# EAGLE design RES8 (EAGLE 5.11)
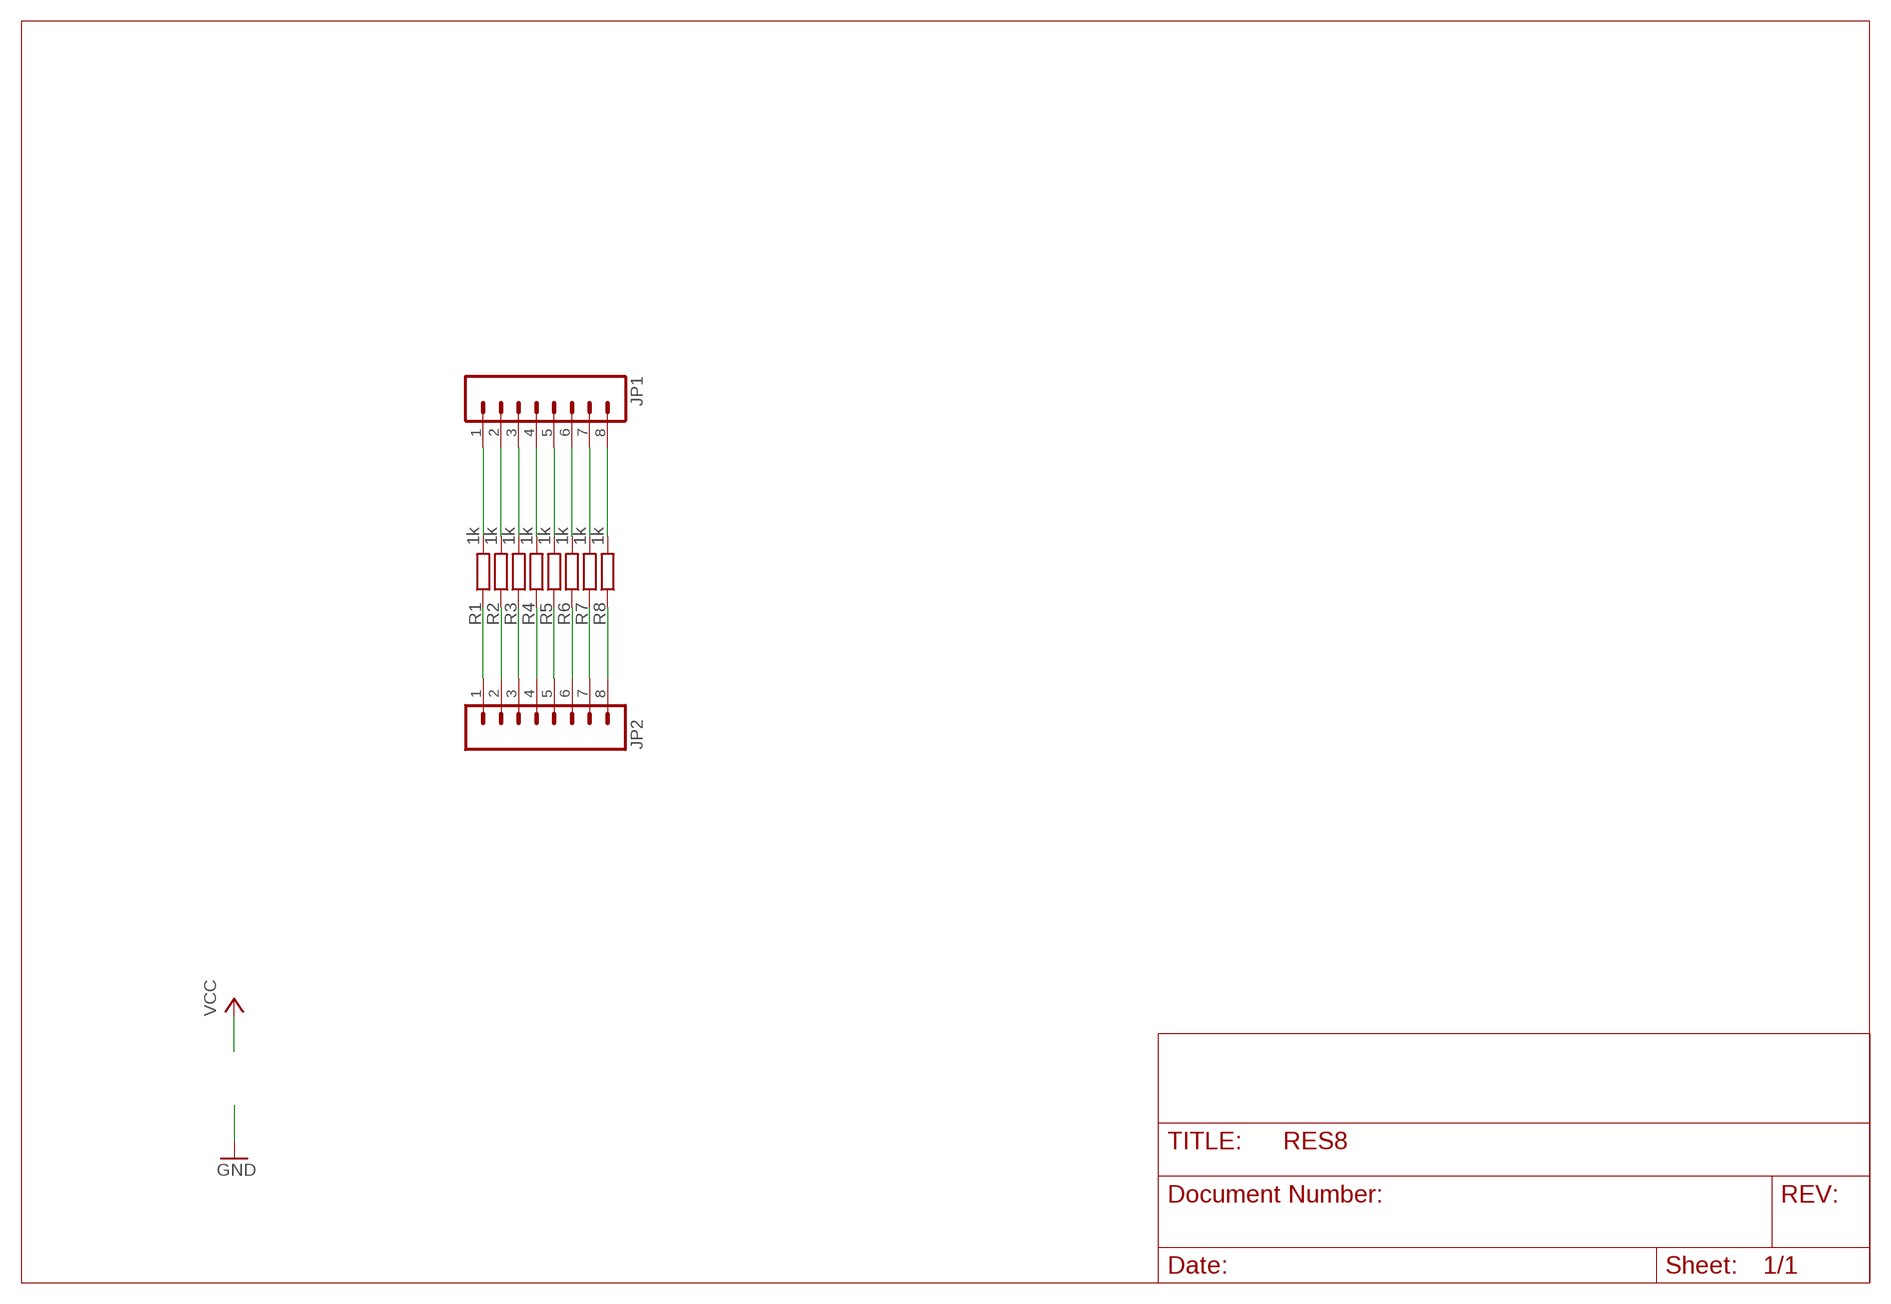
[diagram p0: schematic, sheet 1]

## Parts
JP1  HEADER_1X08PTH  [1X08]
JP2  HEADER_1X08PTH  [1X08]
R1  1k  R-EU_0207/7  [0207/7]
R2  1k  R-EU_0207/7  [0207/7]
R3  1k  R-EU_0207/7  [0207/7]
R4  1k  R-EU_0207/7  [0207/7]
R5  1k  R-EU_0207/7  [0207/7]
R6  1k  R-EU_0207/7  [0207/7]
R7  1k  R-EU_0207/7  [0207/7]
R8  1k  R-EU_0207/7  [0207/7]

## Nets
N$1: JP2.1 R1.1
N$2: JP2.2 R2.1
N$3: JP2.3 R3.1
N$4: JP2.4 R4.1
N$5: JP2.5 R5.1
N$7: JP2.6 R6.1
N$8: JP2.7 R7.1
N$9: JP2.8 R8.1
N$10: JP1.8 R8.2
N$11: JP1.7 R7.2
N$12: JP1.6 R6.2
N$13: JP1.5 R5.2
N$14: JP1.4 R4.2
N$15: JP1.3 R3.2
N$16: JP1.2 R2.2
N$17: JP1.1 R1.2

## Library data of the parts
JP1 JP2 = MyLibrary:HEADER_1X08: Header 8 Standard 8-pin 0.1" header. Use with straight break away headers (SKU : PRT-00116), right angle break away headers (PRT-00553), swiss pins (PRT-00743), machine pins (PRT-00117), and female headers (PRT-00115).
R1-R8 = MyLibrary:R-EU_: RESISTOR, European symbol

## Net classes
0 default: width 0.381 mm, drill 0.9 mm, clearance 0.254 mm
1 GND: width 0.254 mm, drill 0.9 mm, clearance 0.254 mm to class 0, clearance 0.254 mm
2 Border: width 0.254 mm, drill 0.9 mm, clearance 0.254 mm to class 0, clearance 0.254 mm to class 1, clearance 0.254 mm
3 VCC: width 0.635 mm, drill 0.9 mm, clearance 0.254 mm to class 0, clearance 0.254 mm to class 1, clearance 0.254 mm to class 2, clearance 0.254 mm

## Board
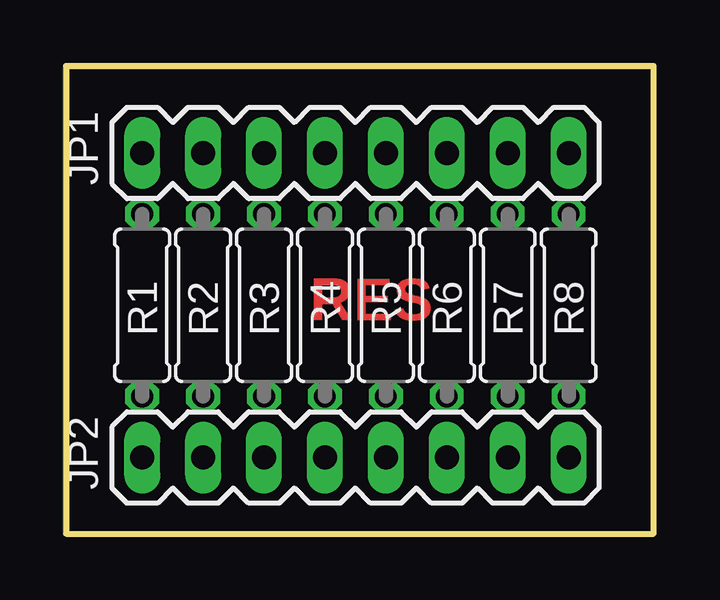
[diagram p1: board, top side]
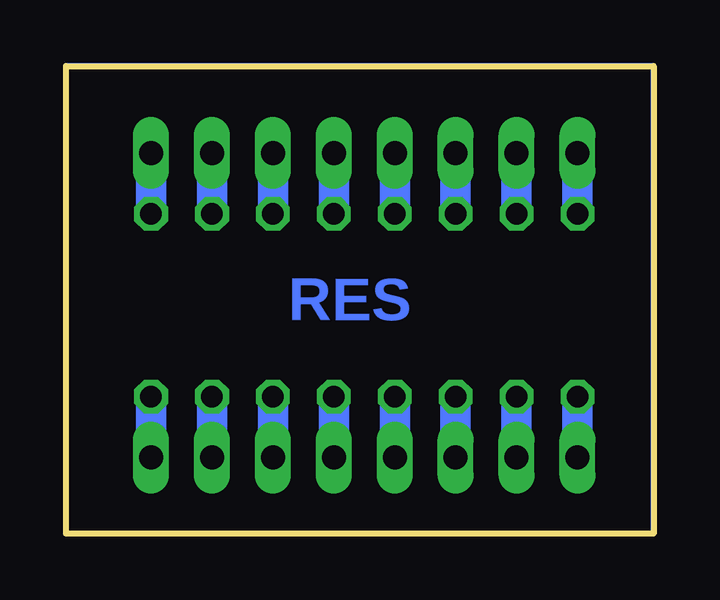
[diagram p2: board, bottom side, seen from below]

Size 24.5 x 19.5 mm. Coordinates in mm from the lower left corner, seen from the top.
Outline: 0,0 24.5,0 24.5,19.5 0,19.5 0,0
Copper layers (1*16): Top 0.035mm / dielectric 1.5mm / Bottom 0.035mm
Design rules "10mils_drill35": minimum track width 10mil, minimum drill 35mil, track to track 10mil, track to pad 10mil, pad to pad 10mil, via to via 10mil, smd to smd 10mil, copper to edge 40mil, drill to drill 10mil, minimum pad ring 10mil, minimum via ring 8mil, stop-mask expansion 0mil, vias tented up to drill 0mil, thermal gap 10mil

### Footprints (pad centres in the part's own frame; a part is rotated, then mirrored left to right if it is on the bottom)
1X08 = drill 1 long: 1 0,0; 2 2.54,0; 3 5.08,0; 4 7.62,0; 5 10.16,0; 6 12.7,0; 7 15.24,0; 8 17.78,0
0207/7 = drill 0.9 octagon: 1 -3.81,0; 2 3.81,0

### Placement (x,y rotation side)
JP1  3.17,15.88 0 top
JP2  3.17,3.17 0 top
R1  3.17,9.53 90 top
R2  5.71,9.53 90 top
R3  8.26,9.53 90 top
R4  10.79,9.53 90 top
R5  13.34,9.53 90 top
R6  15.88,9.53 90 top
R7  18.41,9.53 90 top
R8  20.95,9.53 90 top

### Tracks (layer width: path | path; a pad name or v marks a point on that pad's centre or on a via)
N$1
  Bottom 1.27: JP2.1 R1.1
N$2
  Bottom 1.27: JP2.2 R2.1
N$3
  Bottom 1.27: JP2.3 R3.1
N$4
  Bottom 1.27: JP2.4 R4.1
N$5
  Bottom 1.27: JP2.5 R5.1
N$6
  Bottom 0.254: 0,0 0,19.5 24.5,19.5 24.5,0 0,0
N$7
  Bottom 1.27: JP2.6 R6.1
N$8
  Bottom 1.27: JP2.7 R7.1
N$9
  Bottom 1.27: JP2.8 R8.1
N$10
  Bottom 1.27: R8.2 JP1.8
N$11
  Bottom 1.27: R7.2 JP1.7
N$12
  Bottom 1.27: R6.2 JP1.6
N$13
  Bottom 1.27: R5.2 JP1.5
N$14
  Bottom 1.27: R4.2 JP1.4
N$15
  Bottom 1.27: R3.2 JP1.3
N$16
  Bottom 1.27: R2.2 JP1.2
N$17
  Bottom 1.27: R1.2 JP1.1
N$18
  Top 0.254: 0,0 0,19.5 24.5,19.5 24.5,0 0,0

### Text on the board
Top: RES
Bottom: RES
_tsilk: JP1 | R1 | R2 | R3 | R4 | R5 | R6 | R7 | R8 | JP2
Contour: RES8